# EAGLE schematic rotaryboard (EAGLE 6.5.0)
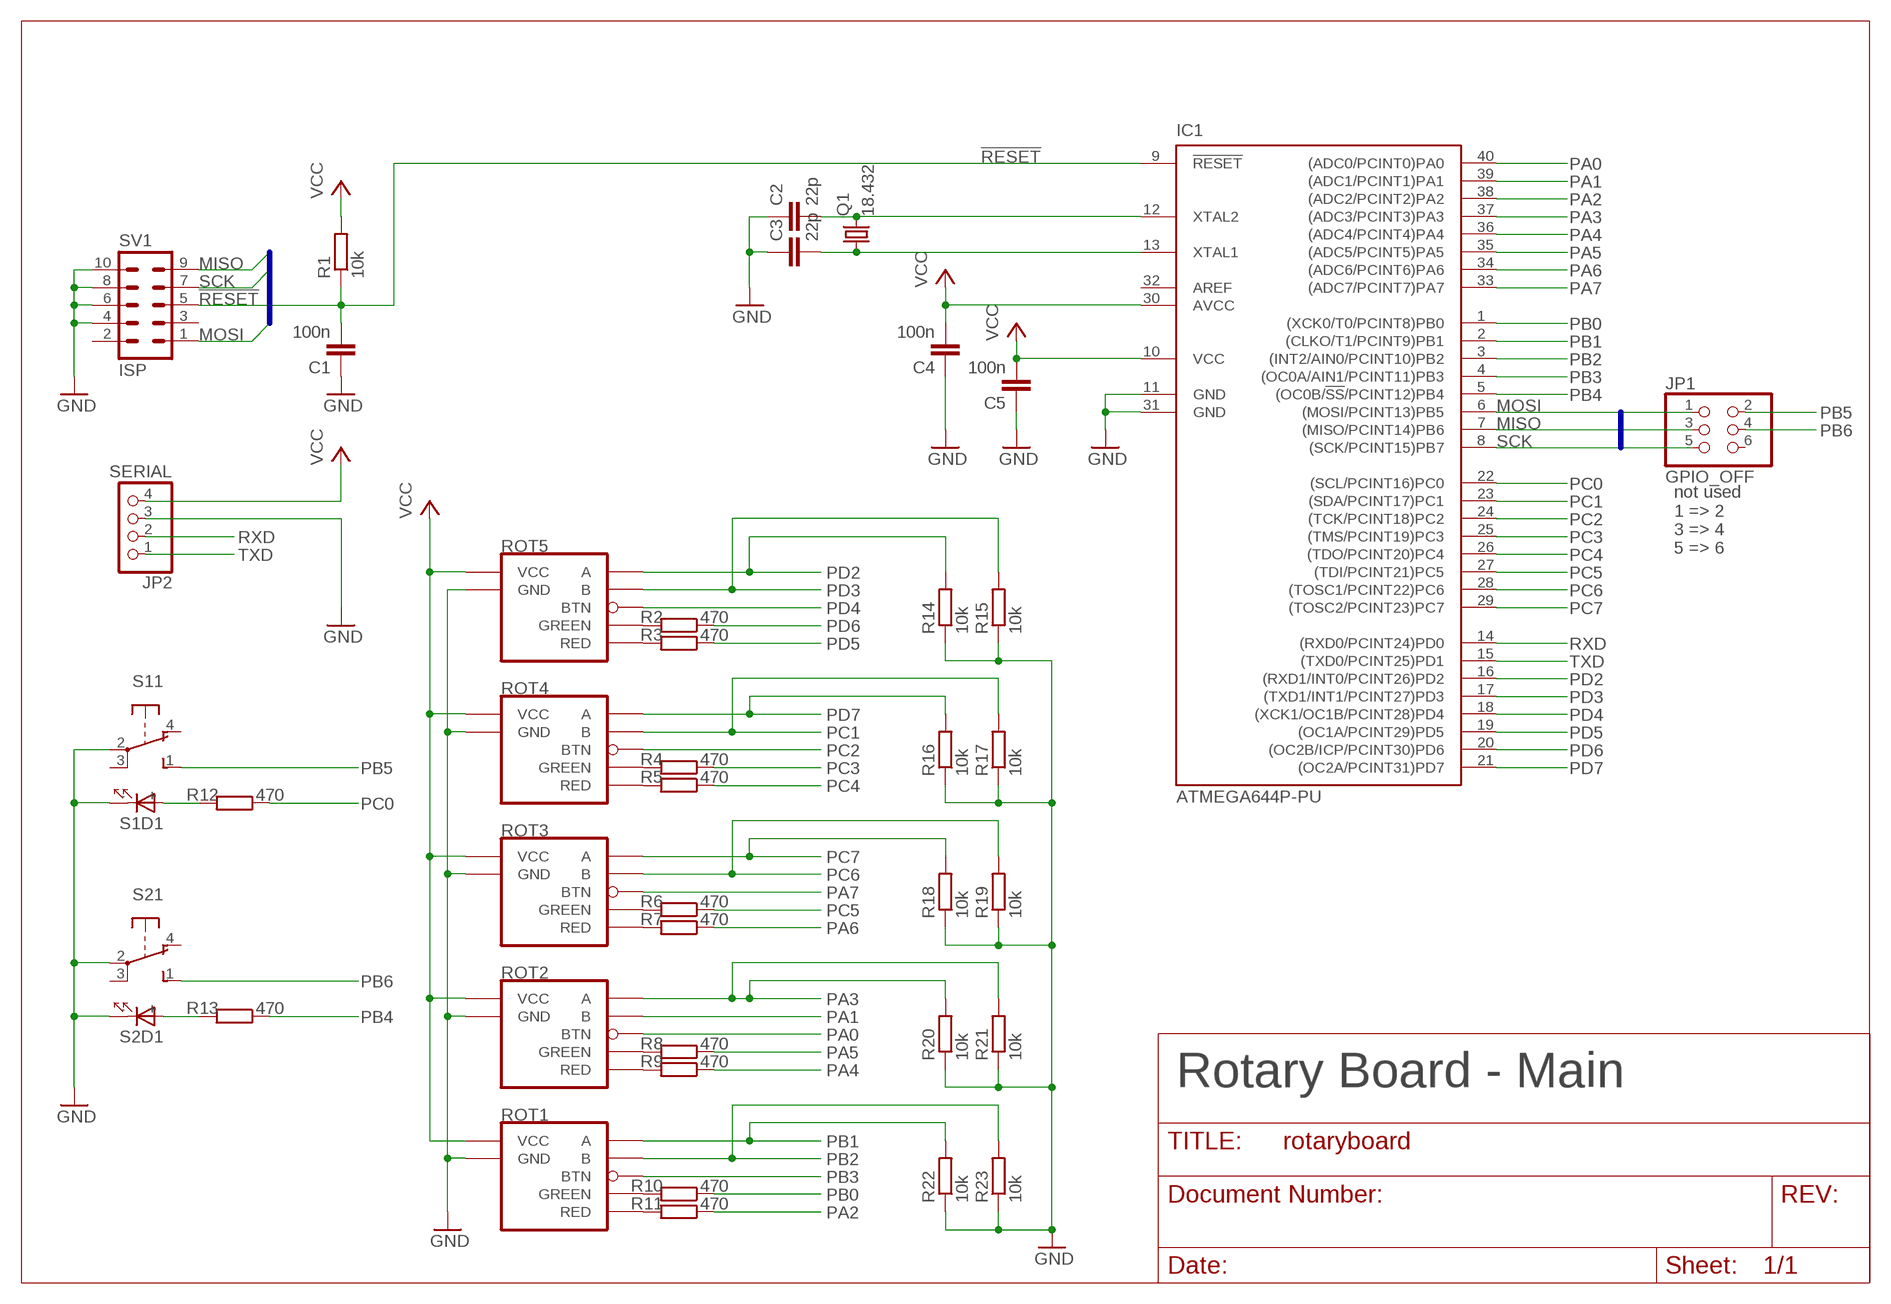
[diagram p0: schematic, sheet 1]

## Parts
C1  100n  C-EU050-025X075  [C050-025X075]
C2  22p  C-EU050-025X075  [C050-025X075]
C3  22p  C-EU050-025X075  [C050-025X075]
C4  100n  C-EU050-025X075  [C050-025X075]
C5  100n  C-EU050-025X075  [C050-025X075]
IC1  ATMEGA644P-PU  MEGA164P/324P/644P-PU  [DIL40]
JP1  GPIO_OFF  PINHD-2X3  [2X03]
JP2  SERIAL  PINHD-1X4  [1X04]
Q1  18.432  CRYSTALHC18U-V  [HC18U-V]
R1  10k  R-EU_0207/10  [0207/10]
R2  470  R-EU_0207/10  [0207/10]
R3  470  R-EU_0207/10  [0207/10]
R4  470  R-EU_0207/10  [0207/10]
R5  470  R-EU_0207/10  [0207/10]
R6  470  R-EU_0207/10  [0207/10]
R7  470  R-EU_0207/10  [0207/10]
R8  470  R-EU_0207/10  [0207/10]
R9  470  R-EU_0207/10  [0207/10]
R10  470  R-EU_0207/10  [0207/10]
R11  470  R-EU_0207/10  [0207/10]
R12  470  R-EU_0207/10  [0207/10]
R13  470  R-EU_0207/10  [0207/10]
R14  10k  R-EU_0207/10  [0207/10]
R15  10k  R-EU_0207/10  [0207/10]
R16  10k  R-EU_0207/10  [0207/10]
R17  10k  R-EU_0207/10  [0207/10]
R18  10k  R-EU_0207/10  [0207/10]
R19  10k  R-EU_0207/10  [0207/10]
R20  10k  R-EU_0207/10  [0207/10]
R21  10k  R-EU_0207/10  [0207/10]
R22  10k  R-EU_0207/10  [0207/10]
R23  10k  R-EU_0207/10  [0207/10]
ROT1  DPL12SVCUSTOM  [DPL12SV]
ROT2  DPL12SVCUSTOM  [DPL12SV]
ROT3  DPL12SVCUSTOM  [DPL12SV]
ROT4  DPL12SVCUSTOM  [DPL12SV]
ROT5  DPL12SVCUSTOM  [DPL12SV]
S1  SRKL  [SRKL]
S2  SRKL  [SRKL]
SV1  ISP  ML10  [ML10]

## Nets
!RESET: C1.2 IC1.9(!RESET) R1.1 SV1.5
GND: C1.1 C2.1 C3.1 C4.1 C5.1 IC1.11(GND) IC1.31(GND) JP2.3 R14.1 R15.1 R16.1 R17.1 R18.1 R19.1 R20.1 R21.1 R22.1 R23.1 ROT1.GND ROT2.GND ROT3.GND ROT4.GND ROT5.GND S1.2(1:P) S1.-(D1:C) S2.2(1:P) S2.-(D1:C) SV1.4 SV1.6 SV1.8 SV1.10
MISO: IC1.7((MISO/PCINT14)PB6) JP1.3 SV1.9
MOSI: IC1.6((MOSI/PCINT13)PB5) JP1.1 SV1.1
N$1: C3.2 IC1.13(XTAL1) Q1.1
N$2: C2.2 IC1.12(XTAL2) Q1.2
N$3: R2.2 ROT5.GREEN
N$4: R3.2 ROT5.RED
N$5: R4.2 ROT4.GREEN
N$6: R5.2 ROT4.RED
N$7: R6.2 ROT3.GREEN
N$8: R7.2 ROT3.RED
N$9: R8.2 ROT2.GREEN
N$10: R9.2 ROT2.RED
N$11: R10.2 ROT1.GREEN
N$12: R11.2 ROT1.RED
N$13: R13.2 S2.+(D1:A)
N$14: R12.2 S1.+(D1:A)
PA0: IC1.40((ADC0/PCINT0)PA0) ROT2.BTN
PA1: IC1.39((ADC1/PCINT1)PA1) ROT2.B
PA2: IC1.38((ADC2/PCINT2)PA2) R11.1
PA3: IC1.37((ADC3/PCINT3)PA3) R20.2 R21.2 ROT2.A
PA4: IC1.36((ADC4/PCINT4)PA4) R9.1
PA5: IC1.35((ADC5/PCINT5)PA5) R8.1
PA6: IC1.34((ADC6/PCINT6)PA6) R7.1
PA7: IC1.33((ADC7/PCINT7)PA7) ROT3.BTN
PB0: IC1.1((XCK0/T0/PCINT8)PB0) R10.1
PB1: IC1.2((CLKO/T1/PCINT9)PB1) R22.2 ROT1.A
PB2: IC1.3((INT2/AIN0/PCINT10)PB2) R23.2 ROT1.B
PB3: IC1.4((OC0A/AIN1/PCINT11)PB3) ROT1.BTN
PB4: IC1.5((OC0B/!SS!/PCINT12)PB4) R13.1
PB5: JP1.2 S1.1(1:S)
PB6: JP1.4 S2.1(1:S)
PC0: IC1.22((SCL/PCINT16)PC0) R12.1
PC1: IC1.23((SDA/PCINT17)PC1) R17.2 ROT4.B
PC2: IC1.24((TCK/PCINT18)PC2) ROT4.BTN
PC3: IC1.25((TMS/PCINT19)PC3) R4.1
PC4: IC1.26((TDO/PCINT20)PC4) R5.1
PC5: IC1.27((TDI/PCINT21)PC5) R6.1
PC6: IC1.28((TOSC1/PCINT22)PC6) R19.2 ROT3.B
PC7: IC1.29((TOSC2/PCINT23)PC7) R18.2 ROT3.A
PD2: IC1.16((RXD1/INT0/PCINT26)PD2) R14.2 ROT5.A
PD3: IC1.17((TXD1/INT1/PCINT27)PD3) R15.2 ROT5.B
PD4: IC1.18((XCK1/OC1B/PCINT28)PD4) ROT5.BTN
PD5: IC1.19((OC1A/PCINT29)PD5) R3.1
PD6: IC1.20((OC2B/ICP/PCINT30)PD6) R2.1
PD7: IC1.21((OC2A/PCINT31)PD7) R16.2 ROT4.A
RXD: IC1.14((RXD0/PCINT24)PD0) JP2.2
SCK: IC1.8((SCK/PCINT15)PB7) JP1.5 SV1.7
TXD: IC1.15((TXD0/PCINT25)PD1) JP2.1
VCC: C4.2 C5.2 IC1.10(VCC) IC1.30(AVCC) JP2.4 R1.2 ROT1.VCC ROT2.VCC ROT3.VCC ROT4.VCC ROT5.VCC
Unconnected: JP1.6 S1.3(1:P) S1.4(1:O) S2.3(1:P) S2.4(1:O) SV1.2 SV1.3

## Buses
PROG:MOSI,MISO,SCK

## Notes on the sheet
- not used
  1 => 2
  3 => 4
  5 => 6
- Rotary Board - Main

## Power pins joined to a net without a drawn wire
AREF: IC1.32(AREF)

## Library data of the parts
C1-C5 = rcl:C-EU: CAPACITOR, European symbol
IC1 = avr-5:MEGA164P/324P/644P-PU
JP1 = pinhead:PINHD-2X3: PIN HEADER
JP2 = pinhead:PINHD-1X4: PIN HEADER
Q1 = crystal:CRYSTAL: CRYSTAL; OC_FARNELL: unknown; OC_NEWARK: unknown
R1-R23 = rcl:R-EU_: RESISTOR, European symbol
ROT1-ROT5 = rotary:DPL12SV: DPL12S rotary encoder with switch and dual-color LED
S1 S2 = switch-misc:SRKL: SWITCH
SV1 = con-harting-ml:ML10: HARTING; OC_FARNELL: unknown; OC_NEWARK: unknown